# Altium schematic sheet Controller.SchDoc: Flight Computer Prototype
size A4; Organization: Altium Limited; Address1: L3, 12a Rodborough Rd; Address2: Frenchs Forest; Address3: NSW; Address4: Australia 2086; Revision: 1.0; SheetNumber: 1; SheetTotal: 4
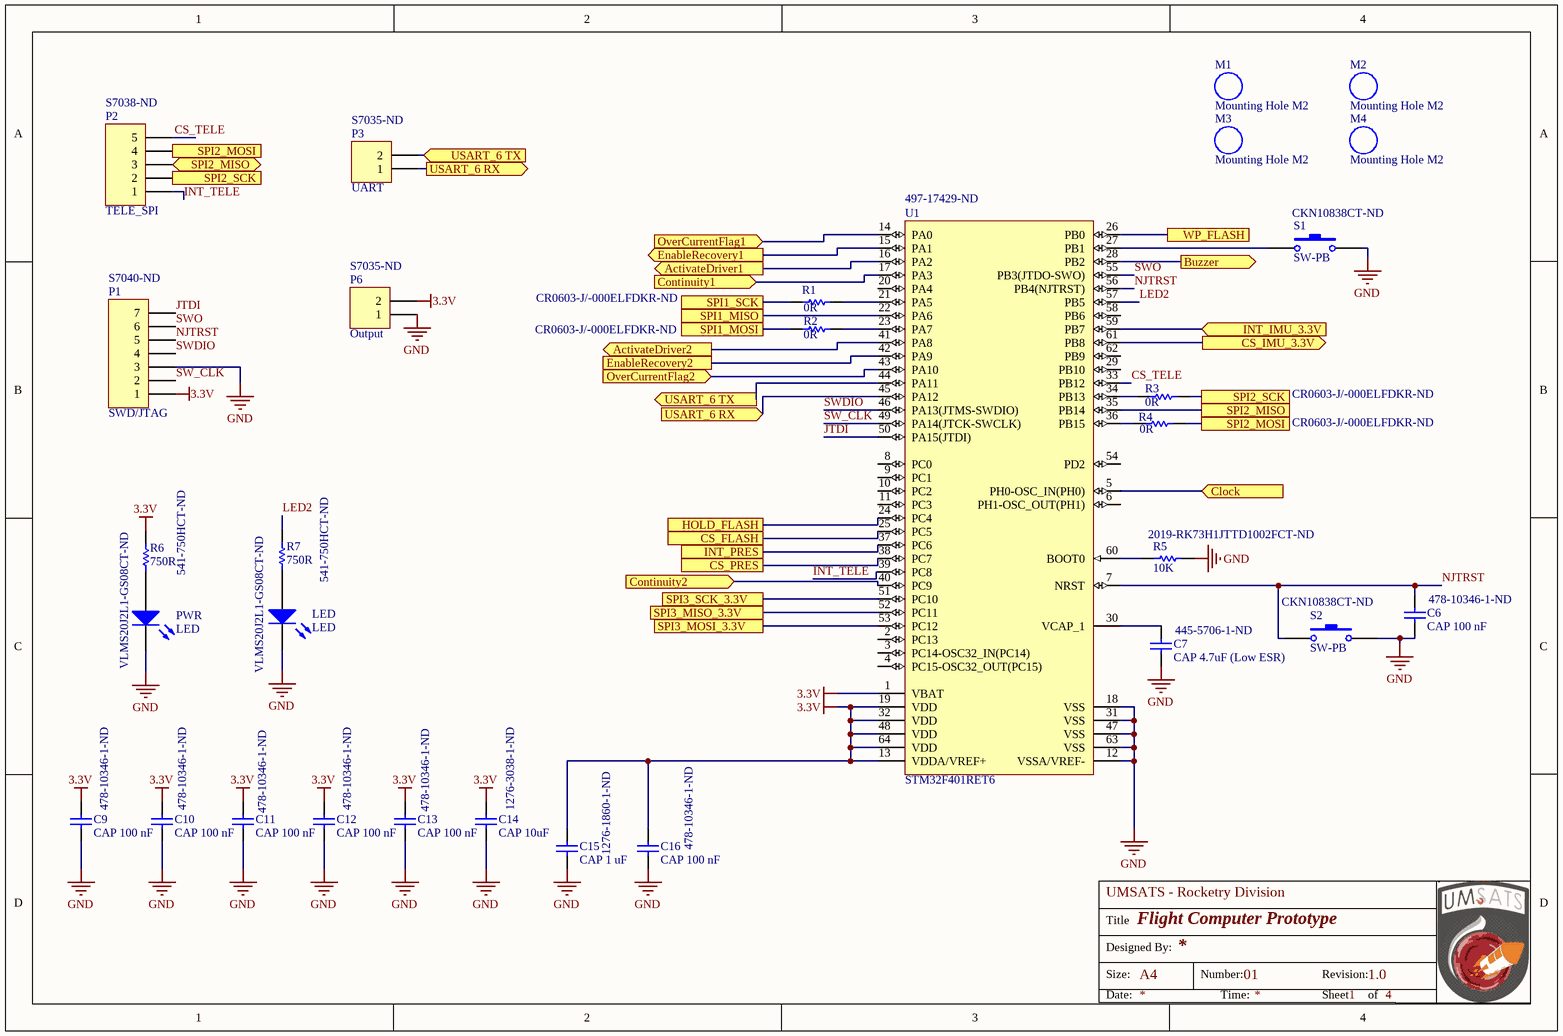
[diagram p0: Controller.SchDoc]

## Parts
C6  CAP 100 nF  Supplier Part Number 1: 478-10346-1-ND  [06035C104KAT4A]
C7  CAP 4.7uF (Low ESR)  Supplier Part Number 1: 445-5706-1-ND  [CGA5L1X7R1E475K160AC]
C9  CAP 100 nF  Supplier Part Number 1: 478-10346-1-ND  [06035C104KAT4A]
C10  CAP 100 nF  Supplier Part Number 1: 478-10346-1-ND  [06035C104KAT4A]
C11  CAP 100 nF  Supplier Part Number 1: 478-10346-1-ND  [06035C104KAT4A]
C12  CAP 100 nF  Supplier Part Number 1: 478-10346-1-ND  [06035C104KAT4A]
C13  CAP 100 nF  Supplier Part Number 1: 478-10346-1-ND  [06035C104KAT4A]
C14  CAP 10uF  Supplier Part Number 1: 1276-3038-1-ND  [CL31A106KAHNFNE]
C15  CAP 1 uF  Supplier Part Number 1: 1276-1860-1-ND  [CL10A105KB8NNNC]
C16  CAP 100 nF  Supplier Part Number 1: 478-10346-1-ND  [06035C104KAT4A]
LED  LED  Supplier Part Number 1: VLMS20J2L1-GS08CT-ND  [Vishay VLMx20 Low Current Mini SMD LED]
M1  Mounting Hole M2  [Mounting Hole M2]
M2  Mounting Hole M2  [Mounting Hole M2]
M3  Mounting Hole M2  [Mounting Hole M2]
M4  Mounting Hole M2  [Mounting Hole M2]
P1  SWD/JTAG  Supplier Part Number 1: S7040-ND  [HDR1X7]
P2  TELE_SPI  Supplier Part Number 1: S7038-ND  [HDR1X5]
P3  UART  Supplier Part Number 1: S7035-ND  [HDR1X2]
P6  Output  Supplier Part Number 1: S7035-ND  [HDR1X2]
PWR  LED  Supplier Part Number 1: VLMS20J2L1-GS08CT-ND  [Vishay VLMx20 Low Current Mini SMD LED]
R1  0R  Supplier Part Number 1: CR0603-J/-000ELFDKR-ND  [CR0603-J/-000ELF]
R2  0R  Supplier Part Number 1: CR0603-J/-000ELFDKR-ND  [CR0603-J/-000ELF]
R3  0R  Supplier Part Number 1: CR0603-J/-000ELFDKR-ND  [CR0603-J/-000ELF]
R4  0R  Supplier Part Number 1: CR0603-J/-000ELFDKR-ND  [CR0603-J/-000ELF]
R5  10K  Supplier Part Number 1: 2019-RK73H1JTTD1002FCT-ND  [RK73H1JTTD1002F]
R6  750R  Supplier Part Number 1: 541-750HCT-ND  [CRCW0603750RFKEA]
R7  750R  Supplier Part Number 1: 541-750HCT-ND  [CRCW0603750RFKEA]
S1  SW-PB  Supplier Part Number 1: CKN10838CT-ND  [PTS530GG065SMTRLFS]
S2  SW-PB  Supplier Part Number 1: CKN10838CT-ND  [PTS530GG065SMTRLFS]
U1  STM32F401RET6  Supplier Part Number 1: 497-17429-ND  [STM-LQFP64_N]

## Ports
ActivateDriver1 (out), ActivateDriver2 (out), Buzzer (out), Clock (in), Continuity1 (in), Continuity2 (in), CS_FLASH, CS_IMU_3.3V (out), CS_PRES, EnableRecovery1 (out), EnableRecovery2, HOLD_FLASH, INT_IMU_3.3V (in), INT_PRES, OverCurrentFlag1 (in), OverCurrentFlag2 (in), SPI1_MISO, SPI1_MOSI, SPI1_SCK, SPI2_MISO, SPI2_MISO (bidir), SPI2_MOSI, SPI2_MOSI (in), SPI2_SCK, SPI2_SCK (in), SPI3_MISO_3.3V, SPI3_MOSI_3.3V, SPI3_SCK_3.3V, USART_6 RX (in), USART_6 RX (out), USART_6 TX (in), USART_6 TX (out), WP_FLASH

## Nets
3.3V: C9.1 C10.1 C11.1 C12.1 C13.1 C14.2 C15.1 C16.1 P1.1 P6.2 R6.2 U1.1(VBAT) U1.13(VDDA/VREF+) U1.19(VDD) U1.32(VDD) U1.48(VDD) U1.64(VDD)
GND: C6.2 C7.2 C9.2 C10.2 C11.2 C12.2 C13.2 C14.1 C15.2 C16.2 LED.2(K) P1.3 P6.1 PWR.2(K) R5.2 S1.2 S2.2 U1.12(VSSA/VREF-) U1.18(VSS) U1.31(VSS) U1.47(VSS) U1.63(VSS)
ActivateDriver1: U1.16(PA2) ; port ActivateDriver1
ActivateDriver2: U1.41(PA8) ; port ActivateDriver2
Buzzer: U1.28(PB2) ; port Buzzer
Clock: U1.5(PH0-OSC_IN(PH0)) ; port Clock
Continuity1: U1.17(PA3) ; port Continuity1
Continuity2: U1.40(PC9) ; port Continuity2
CS_FLASH: U1.25(PC5) ; port CS_FLASH
CS_IMU_3.3V: U1.61(PB8) ; port CS_IMU_3.3V
CS_PRES: U1.38(PC7) ; port CS_PRES
CS_TELE: P2.5 U1.33(PB12)
EnableRecovery1: U1.15(PA1) ; port EnableRecovery1
EnableRecovery2: U1.42(PA9) ; port EnableRecovery2
HOLD_FLASH: U1.24(PC4) ; port HOLD_FLASH
INT_IMU_3.3V: U1.59(PB7) ; port INT_IMU_3.3V
INT_PRES: U1.37(PC6) ; port INT_PRES
INT_TELE: P2.1 U1.39(PC8)
JTDI: P1.7 U1.50(PA15(JTDI))
LED2: R7.2 U1.57(PB5)
NJTRST: C6.1 P1.5 S2.1 U1.7(NRST) U1.56(PB4(NJTRST))
OverCurrentFlag1: U1.14(PA0) ; port OverCurrentFlag1
OverCurrentFlag2: U1.43(PA10) ; port OverCurrentFlag2
SPI1_MISO: U1.22(PA6) ; port SPI1_MISO
SPI1_MOSI: R2.1 ; port SPI1_MOSI
SPI1_SCK: R1.1 ; port SPI1_SCK
SPI2_MISO: P2.3 U1.35(PB14) ; port SPI2_MISO
SPI2_MOSI: P2.4 R4.2 ; port SPI2_MOSI
SPI2_SCK: P2.2 R3.2 ; port SPI2_SCK
SPI3_MISO_3.3V: U1.52(PC11) ; port SPI3_MISO_3.3V
SPI3_MOSI_3.3V: U1.53(PC12) ; port SPI3_MOSI_3.3V
SPI3_SCK_3.3V: U1.51(PC10) ; port SPI3_SCK_3.3V
SW_CLK: P1.2 U1.49(PA14(JTCK-SWCLK))
SWDIO: P1.4 U1.46(PA13(JTMS-SWDIO))
SWO: P1.6 U1.55(PB3(JTDO-SWO))
USART_6 RX: P3.1 U1.45(PA12) ; port USART_6 RX
USART_6 TX: P3.2 U1.44(PA11) ; port USART_6 TX
WP_FLASH: U1.26(PB0) ; port WP_FLASH
NetC7_1: C7.1 U1.30(VCAP_1)
NetLED_1: LED.1(A) R7.1
NetPWR_1: PWR.1(A) R6.1
NetR1_2: R1.2 U1.21(PA5)
NetR2_2: R2.2 U1.23(PA7)
NetR3_1: R3.1 U1.34(PB13)
NetR4_1: R4.1 U1.36(PB15)
NetR5_1: R5.1 U1.60(BOOT0)
NetS1_1: S1.1 U1.27(PB1)

Not connected (* = marked no-connect by the designer): U1 2(PC13) 3(PC14-OSC32_IN(PC14)) 4(PC15-OSC32_OUT(PC15)) 6(PH1-OSC_OUT(PH1)) 8(PC0) 9(PC1) 10(PC2) 11(PC3) 20(PA4) 29(PB10) 54(PD2) 58(PB6) 62(PB9)

## Notes on the sheet
- Title
- UMSATS - Rocketry Division
- Designed By:
- Size:
- A4
- Number:
- 01
- Revision:
- Date:
- Time:
- Sheet
- of

## Library data of the parts
C6 C7 C9-C16 = Cap: Capacitor; Published: 8-Jun-2000; LatestRevisionDate: 17-Jul-2002; LatestRevisionNote: Re-released for DXP Platform.; Publisher: Altium Limited; Supplier 1: Digi-Key
  C14: PackageReference: RAD-0.3; PackageDescription: Radial Cap, Thru-Hole; 2 Leads; 0.3 in Pin Spacing; Value: 10uF
LED PWR = LED2: Typical RED, GREEN, YELLOW, AMBER GaAs LED; Published: 8-Jun-2000; LatestRevisionDate: 17-Jul-2002; LatestRevisionNote: Re-released for DXP Platform.; PackageVersion: Feb-2002; PackageReference: 3.2X1.6X1.1; Publisher: Altium Limited; PackageDescription: SM LED; 2 Flat Leads; Supplier 1: Digi-Key
P1 = Header 7: Header, 7-Pin; LatestRevisionDate: 17-Jul-2002; LatestRevisionNote: Re-released for DXP Platform.; Publisher: Altium Limited; Supplier 1: Digi-Key
P2 = Header 5: Header, 5-Pin; LatestRevisionDate: 17-Jul-2002; LatestRevisionNote: Re-released for DXP Platform.; Publisher: Altium Limited; Supplier 1: Digi-Key
P3 P6 = Header 2: Header, 2-Pin; LatestRevisionDate: 17-Jul-2002; LatestRevisionNote: Re-released for DXP Platform.; Publisher: Altium Limited; Supplier 1: Digi-Key
R1-R7 = Res1: Resistor; Value: 1K; Published: 8-Jun-2000; LatestRevisionDate: 17-Jul-2002; LatestRevisionNote: Re-released for DXP Platform.; PackageReference: AXIAL-0.3; Publisher: Altium Limited; PackageDescription: Axial Device, Thru-Hole; 2 Leads; 0.3 in Pin Spacing; Supplier 1: Digi-Key
S1 S2 = SW-PB: Switch; Published: 24-Mar-1999; LatestRevisionDate: 17-Jul-2002; LatestRevisionNote: Re-released for DXP Platform.; PackageReference: SPST-2; Publisher: Altium Limited; PackageDescription: Switch; 2 Leads; Supplier 1: Digi-Key
U1 = STM32F401RET6: ARM Cortex-M4 32-bit MCU+FPU, 512 KB Flash, 96 KB Internal RAM, 50 I/Os, 64-Pin LQFP, -40 to 85 degC, Tray; Supply Voltage(Vcc) min (V): 1.7; Internal RAM Size (kB): 96; I/Os (High Current): 50; Operating Frequency(F) (Processor speed) (MHz): 84; FLASH Size (Prog) (kB): 512; Package Reference: 64-Pin Low-profile Quad Flat Package, Body 10 x 10 mm, Pitch 0.5 mm; Packing: Tray; DatasheetVersion: Rev. 3; Mounting Technology: Surface Mount; ComponentLink1Description: Manufacturer URL; Package Description: LQFP64; Core: ARM Cortex-M4; ComponentLink1URL: http://www.st.com/; ComponentLink2URL: http://www.st.com/st-web-ui/static/active/en/resource/technical/document/datasheet/DM00102166.pdf; ComponentLink2Description: Datasheet; Supplier 1: Digi-Key